# EasyEDA Pro project ProProject_TDeck_18650_Charger_2024-02-11.epro

# Schematic Schematic1
Create Date: 2024-02-10; Page Name: P1; Project Name: TDeck_18650_Charger; Schematic Name: Schematic1; Update Date: 2024-02-10; Company: EasyEDA.com; Drawn: EasyEDA; Page Size: A4; Part Number: JLCPCB-002; Reviewed: EasyEDA; Version: V0.1
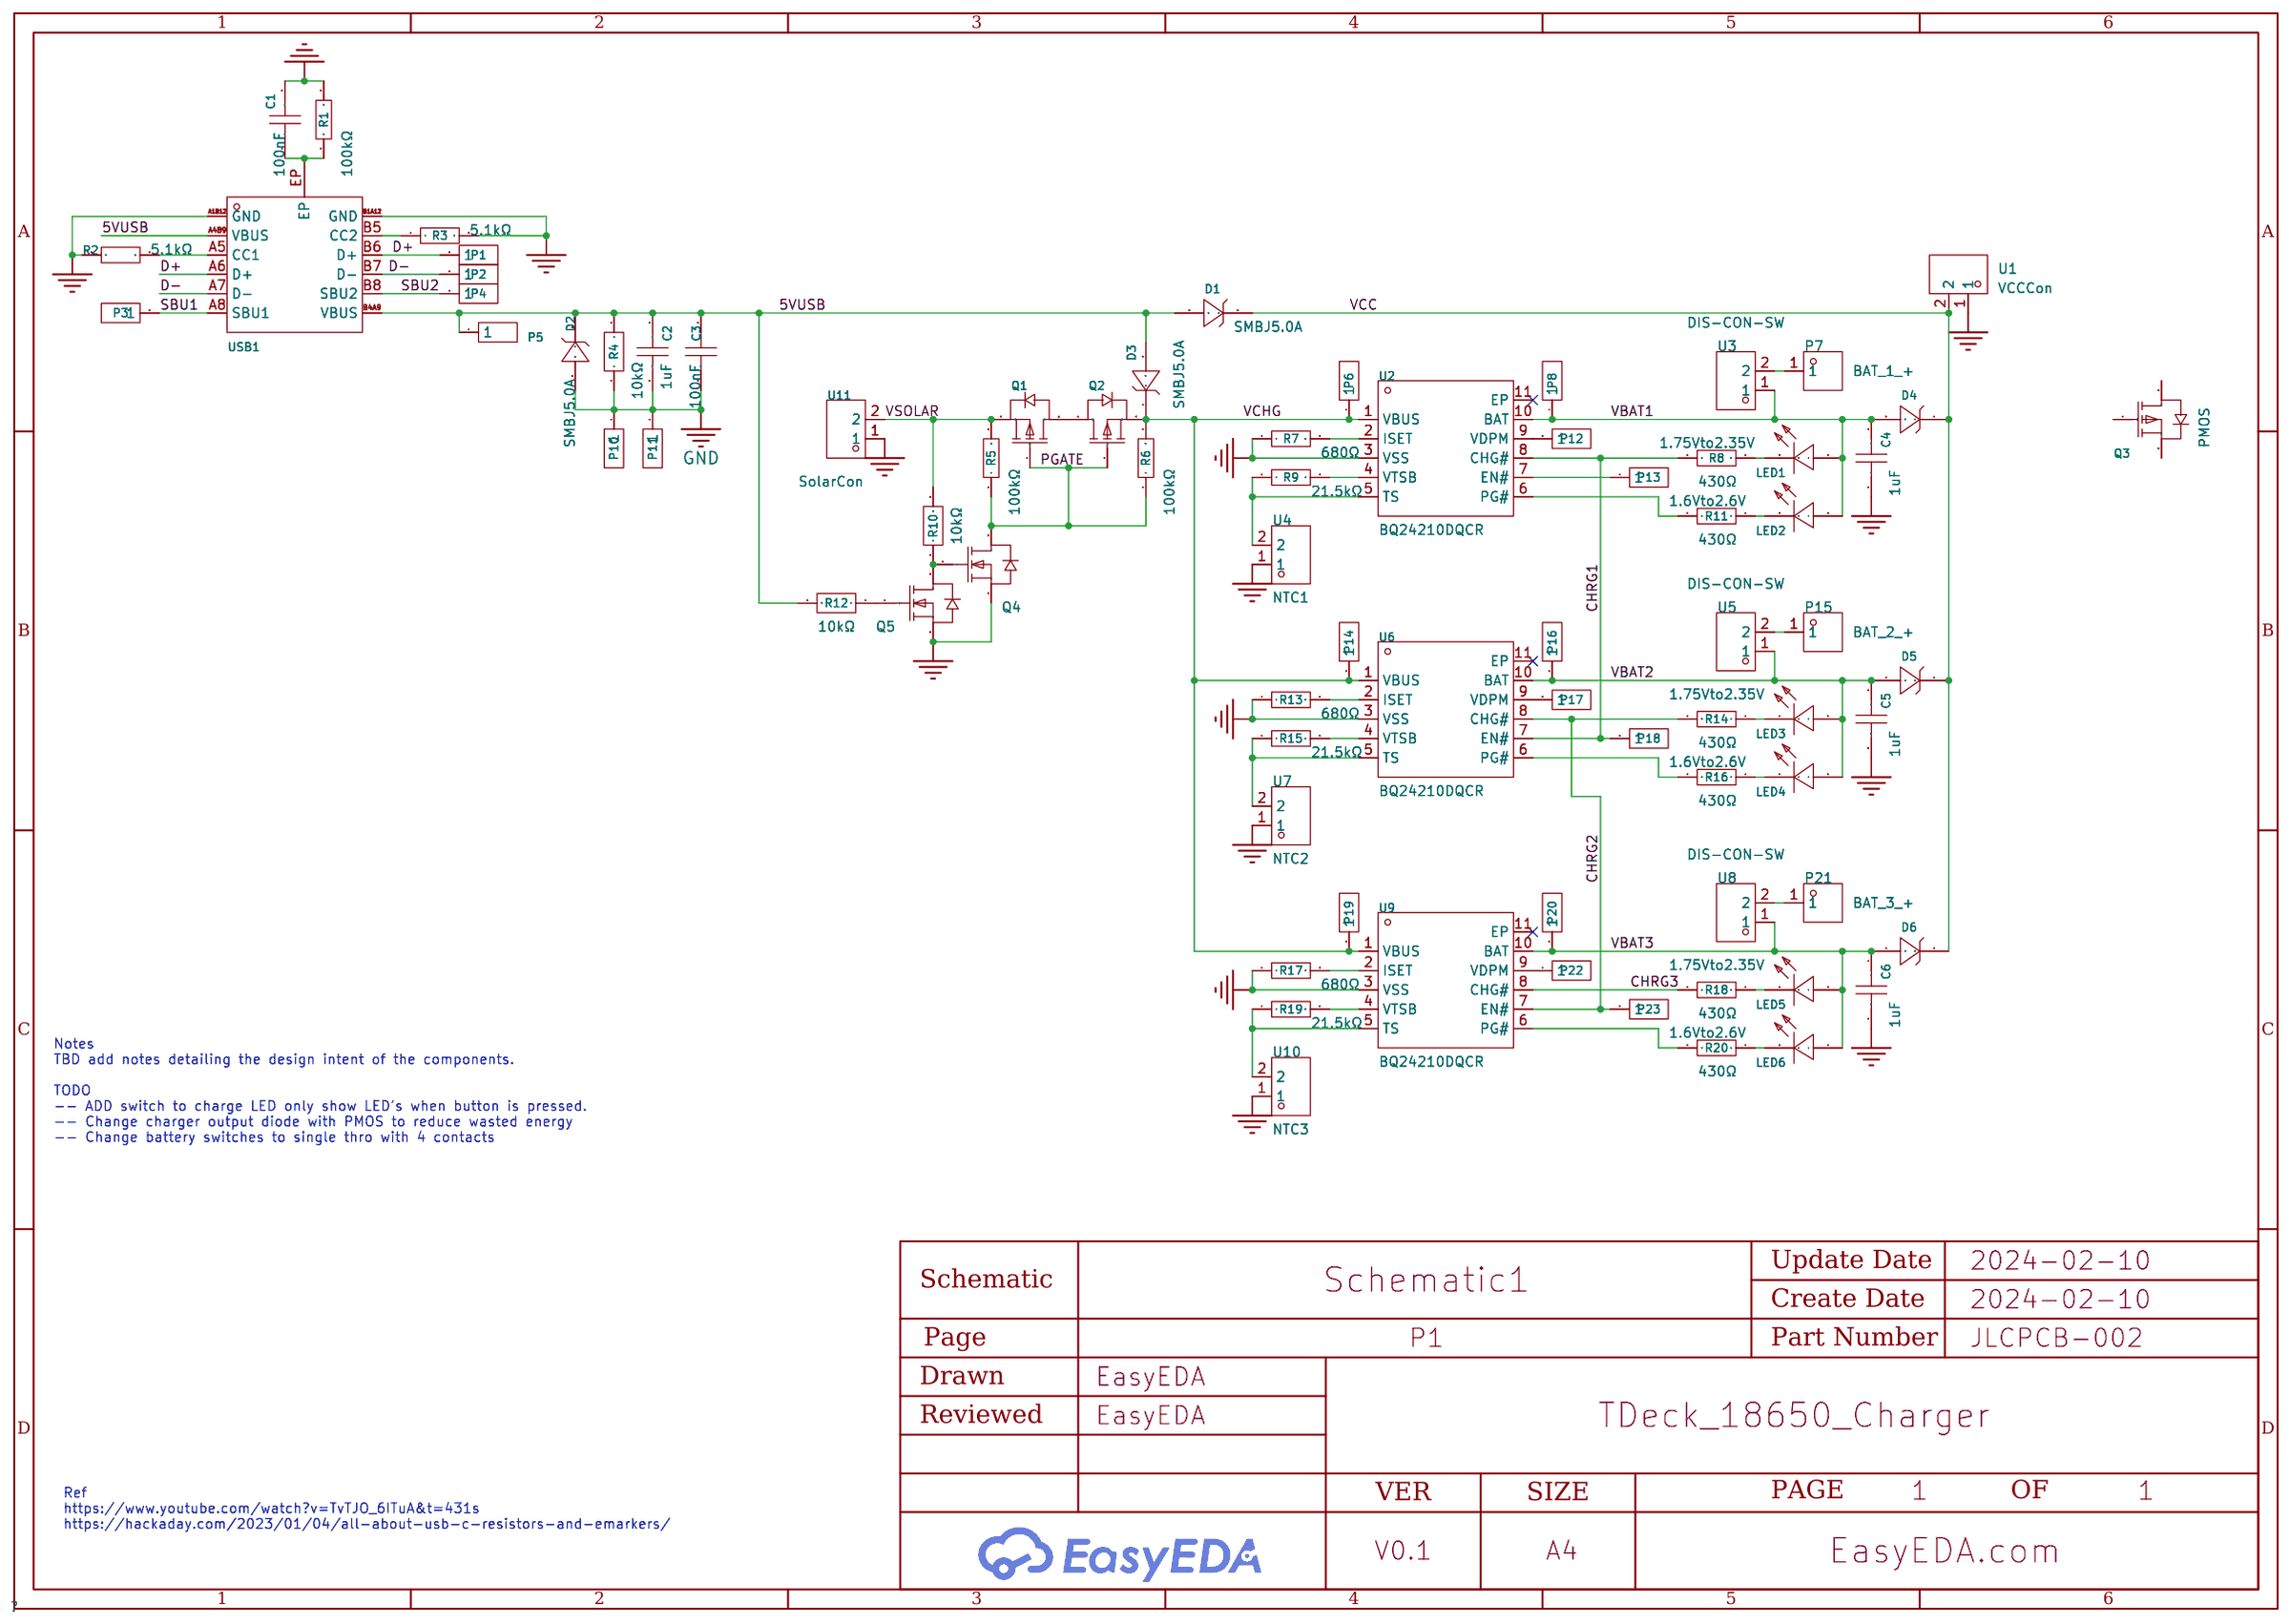
[diagram p0: schematic sheet]

## Parts
C1  100nF  [C0603]
C2  1uF  [C1206]
C3  100nF  [C0603]
C4  1uF  [C1206]
C5  1uF  [C1206]
C6  1uF  [C1206]
D1  SMBJ5.0A  [SMB_L4.4-W3.6-LS5.2-RD]
D2  SMBJ5.0A  [SMB_L4.4-W3.6-LS5.2-RD]
D3  SMBJ5.0A  [SMB_L4.4-W3.6-LS5.2-RD]
D4  SMBJ5.0A  [SMB_L4.4-W3.6-LS5.2-RD]
D5  SMBJ5.0A  [SMB_L4.4-W3.6-LS5.2-RD]
D6  SMBJ5.0A  [SMB_L4.4-W3.6-LS5.2-RD]
LED1  1.75Vto2.35V  [LED0805-RD]
LED2  1.6Vto2.6V  [LED0603-RD]
LED3  1.75Vto2.35V  [LED0805-RD]
LED4  1.6Vto2.6V  [LED0603-RD]
LED5  1.75Vto2.35V  [LED0805-RD]
LED6  1.6Vto2.6V  [LED0603-RD]
P1  2.54-1*1P针  [HDR-TH_1P-P2.54-V-M]  (no BOM)
P2  2.54-1*1P针  [HDR-TH_1P-P2.54-V-M]  (no BOM)
P3  2.54-1*1P针  [HDR-TH_1P-P2.54-V-M]  (no BOM)
P4  2.54-1*1P针  [HDR-TH_1P-P2.54-V-M]  (no BOM)
P5  2.54-1*1P针  [HDR-TH_1P-P2.54-V-M]  (no BOM)
P6  2.54-1*1P针  [HDR-TH_1P-P2.54-V-M]
P7  BAT_1_+  [SMD_BD4.0-L4.0-W4.0-D1.0]
P8  2.54-1*1P针  [HDR-TH_1P-P2.54-V-M]
P10  2.54-1*1P针  [HDR-TH_1P-P2.54-V-M]
P11  2.54-1*1P针  [HDR-TH_1P-P2.54-V-M]
P12  2.54-1*1P针  [HDR-TH_1P-P2.54-V-M]  (no BOM)
P13  2.54-1*1P针  [HDR-TH_1P-P2.54-V-M]  (no BOM)
P14  2.54-1*1P针  [HDR-TH_1P-P2.54-V-M]
P15  BAT_2_+  [SMD_BD4.0-L4.0-W4.0-D1.0]
P16  2.54-1*1P针  [HDR-TH_1P-P2.54-V-M]
P17  2.54-1*1P针  [HDR-TH_1P-P2.54-V-M]  (no BOM)
P18  2.54-1*1P针  [HDR-TH_1P-P2.54-V-M]  (no BOM)
P19  2.54-1*1P针  [HDR-TH_1P-P2.54-V-M]
P20  2.54-1*1P针  [HDR-TH_1P-P2.54-V-M]
P21  BAT_3_+  [SMD_BD4.0-L4.0-W4.0-D1.0]
P22  2.54-1*1P针  [HDR-TH_1P-P2.54-V-M]  (no BOM)
P23  2.54-1*1P针  [HDR-TH_1P-P2.54-V-M]  (no BOM)
Q1  SI2301  [SOT-23-3_L2.9-W1.3-P1.90-LS2.4-BR]
Q2  SI2301  [SOT-23-3_L2.9-W1.3-P1.90-LS2.4-BR]
Q3  PMOS  [SOT-23-3_L2.9-W1.3-P1.90-LS2.4-BR]
Q4  AO3400A  [SOT-23-3_L2.9-W1.6-P1.90-LS2.8-BR]
Q5  AO3400A  [SOT-23-3_L2.9-W1.6-P1.90-LS2.8-BR]
R1  100kΩ  [R0805]
R2  5.1kΩ  [R0805]
R3  5.1kΩ  [R0805]
R4  10kΩ  [R0805]
R5  100kΩ  [R0805]
R6  100kΩ  [R0805]
R7  680Ω  [R0805]
R8  430Ω  [R0603]
R9  21.5kΩ  [R0805]
R10  10kΩ  [R0805]
R11  430Ω  [R0603]
R12  10kΩ  [R0805]
R13  680Ω  [R0805]
R14  430Ω  [R0603]
R15  21.5kΩ  [R0805]
R16  430Ω  [R0603]
R17  680Ω  [R0805]
R18  430Ω  [R0603]
R19  21.5kΩ  [R0805]
R20  430Ω  [R0603]
U1  VCCCon  [HDR-TH_2P-P2.54-V-M-2]
U2  BQ24210DQCR  [WSON-10_L3.0-W2.0-P0.50-BL-EP]
U3  DIS-CON-SW  [HDR-TH_2P-P2.54-V-M-2]
U4  NTC1  [HDR-TH_2P-P2.54-V-M-2]
U5  DIS-CON-SW  [HDR-TH_2P-P2.54-V-M-2]
U6  BQ24210DQCR  [WSON-10_L3.0-W2.0-P0.50-BL-EP]
U7  NTC2  [HDR-TH_2P-P2.54-V-M-2]
U8  DIS-CON-SW  [HDR-TH_2P-P2.54-V-M-2]
U9  BQ24210DQCR  [WSON-10_L3.0-W2.0-P0.50-BL-EP]
U10  NTC3  [HDR-TH_2P-P2.54-V-M-2]
U11  SolarCon  [CONN-TH_XY308-2.54-2P]
USB1  TYPEC-304-ACP16  [USB-C-SMD_TYPE-C-16P-1]

## Library data of the parts
C1 C3 = CC0603KRX7R9BB104: Capacitance: Tolerance:±10% Tolerance:±10% Voltage Rated: Temperature Coefficient:; LCSC Part Name: 100nF ±10% 50V; Supplier Part: C14663; Manufacturer: YAGEO(国巨); Supplier Footprint: 0603; JLCPCB Part Class: Basic Part; Datasheet: https://atta.szlcsc.com/upload/public/pdf/source/20180910/C282072_33301C7F631E79921B82A8DAC6BCC5B3.pdf; Supplier: LCSC; Tolerance: ±10%
C2 C4-C6 = CL31B105KCHNNNE: Capacitance: Tolerance:±10% Tolerance:±10% Voltage Rated: Temperature Coefficient:; LCSC Part Name: 1uF ±10% 100V; Supplier Part: C13832; Manufacturer: SAMSUNG(三星); Supplier Footprint: 1206; JLCPCB Part Class: Extended Part; Datasheet: https://atta.szlcsc.com/upload/public/pdf/source/20160218/1457707763339.pdf; Supplier: LCSC; Tolerance: ±10%
D1-D6 = SMBJ5.0A_C3012487: Reverse Stand-Off Voltage (Vrwm):5V Maximum Clamping Voltage:9.2V Peak Pulse Current (Ipp)@10/1000us:65.3A Peak Pulse Power Dissipation (Ppp)@10/1000us:600W Breakdown Voltage:6.4V Reverse Leakage Current (Ir):500uA Type:TVS; Supplier Part: C3012487; Manufacturer: PAKER(派克微); Supplier Footprint: SMB; JLCPCB Part Class: Extended Part; Datasheet: https://atta.szlcsc.com/upload/public/pdf/source/20220607/3D2A7659A4820C4AE9AE78D6D582D662.pdf; Supplier: LCSC; Reverse Stand-Off Voltage (Vrwm): 5V; Maximum Clamping Voltage: 9.2V; Peak Pulse Current (Ipp)@10/1000us: 65.3A; Peak Pulse Power Dissipation (Ppp)@10/1000us: 600W; Breakdown Voltage: 6.4V; Reverse Leakage Current (Ir): 500uA; Type: TVS
LED1 LED3 LED5 = 17-21/R6C-AQ2R2B/3T: Emitted Color:Red; LCSC Part Name: 停产; Supplier Part: C113551; Manufacturer: EVERLIGHT(亿光); Supplier Footprint: 0805; JLCPCB Part Class: Extended Part; Datasheet: https://atta.szlcsc.com/upload/public/pdf/source/20170914/C113551_1505373979236968871.pdf; Supplier: LCSC; Emitted Color: Red
LED2 LED4 LED6 = NCD0603O2: Emitted Color:Orange Forward Voltage (VF):1.6V~2.6V Forward Voltage (VF):1.6V~2.6V Power Dissipation:65mW Forward Current:20mA Dominant Wavelength:600nm~610nm Dominant Wavelength:600nm~610nm Lens Color:无色透明透镜 Luminous Intensity:100mcd~220mcd Luminous Inte; Supplier Part: C108553; Manufacturer: 国星光电; Supplier Footprint: 0603; JLCPCB Part Class: Extended Part; Datasheet: https://atta.szlcsc.com/upload/public/pdf/source/20200820/C108553_1D8FD80A6A2BFA59936C6C85D97A3AAD.pdf; Supplier: LCSC; Emitted Color: Orange; Forward Voltage (VF): 1.6V~2.6V; Power Dissipation: 65mW; Forward Current: 20mA; Dominant Wavelength: 600nm~610nm; Lens Color: 无色透明透镜; Luminous Intensity: 100mcd~220mcd; Viewing Angle: 130°; Operating Temperature: -30℃~+85℃
P1-P6 P8 P10-P14 P16-P20 P22 P23 = 2.54-1*1P针: Pin Structure:- Pitch:- Row Spacing:- Circluar Pins/Square Pins:- Mounting Type:Straight Number of Rows:Plugin Number of Pins:1P Current Rating (Max):- Voltage Rating (Max):- Length of Mating Pin:- Insulation Height:- Contact Material: Contact Plating:- C; LCSC Part Name: 直插; Supplier Part: C81276; Manufacturer: BOOMELE(博穆精密); Supplier Footprint: 插件,P=2.54mm; JLCPCB Part Class: Extended Part; Datasheet: https://atta.szlcsc.com/upload/public/pdf/source/20221018/3E9408392E35E6F57A28985E5F7BF5C9.pdf; Supplier: LCSC; Mounting Type: Straight; Number of Rows: Plugin; Number of Pins: 1P; Color: Black
P7 P15 P21 = PAD: Supplier Part: C9900017271; JLCPCB Part Class: Extended Part; Supplier: LCSC
Q1 Q2 = SI2301_C2891731: Type: Drain Source Voltage (Vdss): Continuous Drain Current (Id): Power Dissipation (Pd): Drain Source On Resistance (RDS(on)@Vgs,Id):120mΩ@4.5V,1.5A Gate Threshold Voltage (Vgs(th)@Id):1.5V@250uA Total Gate Charge (Qg@Vgs):- Input Capacitance (Ciss@Vds):; LCSC Part Name: P沟道 耐压:20V 电流:2.2A; Supplier Part: C2891731; Manufacturer: YONGYUTAI(永裕泰); Supplier Footprint: SOT-23; JLCPCB Part Class: Extended Part; Datasheet: https://atta.szlcsc.com/upload/public/pdf/source/20210901/BD7F488CADB80954861F21BEE026F08A.pdf; Supplier: LCSC; Drain Source On Resistance (RDS(on)@Vgs,Id): 120mΩ@4.5V,1.5A; Gate Threshold Voltage (Vgs(th)@Id): 1.5V@250uA; Input Capacitance (Ciss@Vds): 200pF@10V
Q3 = SI2301_C2891731: Type: Drain Source Voltage (Vdss): Continuous Drain Current (Id): Power Dissipation (Pd): Drain Source On Resistance (RDS(on)@Vgs,Id):120mΩ@4.5V,1.5A Gate Threshold Voltage (Vgs(th)@Id):1.5V@250uA Total Gate Charge (Qg@Vgs):- Input Capacitance (Ciss@Vds):; LCSC Part Name: P沟道 耐压:20V 电流:2.2A; Supplier Part: C2891731; Manufacturer: YONGYUTAI(永裕泰); Manufacturer Part: SI2301; Supplier Footprint: SOT-23; JLCPCB Part Class: Extended Part; Datasheet: https://atta.szlcsc.com/upload/public/pdf/source/20210901/BD7F488CADB80954861F21BEE026F08A.pdf; Supplier: LCSC; Drain Source On Resistance (RDS(on)@Vgs,Id): 120mΩ@4.5V,1.5A; Gate Threshold Voltage (Vgs(th)@Id): 1.5V@250uA; Input Capacitance (Ciss@Vds): 200pF@10V
Q4 Q5 = AO3400A_C20917: Type: Drain Source Voltage (Vdss): Continuous Drain Current (Id): Power Dissipation (Pd): Drain Source On Resistance (RDS(on)@Vgs,Id):26.5mΩ@10V,5.7A Gate Threshold Voltage (Vgs(th)@Id):1.5V@250uA Total Gate Charge (Qg@Vgs):7nC@4.5V Input Capacitance (Cis; LCSC Part Name: N沟道 耐压:30V 电流:5.7A; Supplier Part: C20917; Manufacturer: AOS; Supplier Footprint: SOT-23-3L; JLCPCB Part Class: Basic Part; Datasheet: https://atta.szlcsc.com/upload/public/pdf/source/20140107/1457706668533.pdf; Supplier: LCSC; Drain Source On Resistance (RDS(on)@Vgs,Id): 26.5mΩ@10V,5.7A; Gate Threshold Voltage (Vgs(th)@Id): 1.5V@250uA; Total Gate Charge (Qg@Vgs): 7nC@4.5V; Input Capacitance (Ciss@Vds): 630pF@15V; Operating Temperature: -55℃~+150℃@(Tj)
R1 R5 R6 = 0805W8F1003T5E: Type:Thick Film Resistors Resistance:100kΩ Tolerance:±1% Tolerance:±1% Power(Watts): Overload Voltage (Max): Temperature Coefficient:±100ppm/℃ Temperature Coefficient:±100ppm/℃ Operating Temperature Range:-55℃~+155℃ Operating Temperature Range:-55℃~+155℃; LCSC Part Name: 100kΩ ±1% 125mW 厚膜电阻; Supplier Part: C149504; Manufacturer: UNI-ROYAL(厚声); Supplier Footprint: 0805; JLCPCB Part Class: Basic Part; Datasheet: https://atta.szlcsc.com/upload/public/pdf/source/20200306/C422600_1E6D84923E4A46A82E41ADD87F860B5C.pdf; Supplier: LCSC; Type: Thick Film Resistors; Tolerance: ±1%; Temperature Coefficient: ±100ppm/℃; Operating Temperature Range: -55℃~+155℃
R2 R3 = 0805W8F5101T5E: Type:Thick Film Resistors Resistance:5.1kΩ Tolerance:±1% Tolerance:±1% Power(Watts): Overload Voltage (Max): Temperature Coefficient:±100ppm/℃ Temperature Coefficient:±100ppm/℃ Operating Temperature Range:-55℃~+155℃ Operating Temperature Range:-55℃~+155℃; LCSC Part Name: 5.1kΩ ±1% 125mW 厚膜电阻; Supplier Part: C27834; Manufacturer: UNI-ROYAL(厚声); Supplier Footprint: 0805; JLCPCB Part Class: Basic Part; Datasheet: https://atta.szlcsc.com/upload/public/pdf/source/20200306/C422600_1E6D84923E4A46A82E41ADD87F860B5C.pdf; Supplier: LCSC; Type: Thick Film Resistors; Tolerance: ±1%; Temperature Coefficient: ±100ppm/℃; Operating Temperature Range: -55℃~+155℃
R4 R10 R12 = AR05DTD1002: Resistance: Tolerance:±0.5% Tolerance:±0.5% Temperature Coefficient:±50ppm/℃ Temperature Coefficient:±50ppm/℃; LCSC Part Name: 10kΩ ±0.5%; Supplier Part: C5120082; Manufacturer: Viking(光颉); Supplier Footprint: 0805; JLCPCB Part Class: Extended Part; Datasheet: https://atta.szlcsc.com/upload/public/pdf/source/20220808/FEB8974641219B05EC1DF578AF1AC27C.pdf; Supplier: LCSC; Tolerance: ±0.5%; Temperature Coefficient: ±50ppm/℃
R7 R13 R17 = 0805W8F6800T5E: Type:Thick Film Resistors Resistance: Tolerance:±1% Tolerance:±1% Power(Watts): Overload Voltage (Max): Temperature Coefficient:±100ppm/℃ Temperature Coefficient:±100ppm/℃ Operating Temperature Range:-55℃~+155℃ Operating Temperature Range:-55℃~+155℃; LCSC Part Name: 680Ω ±1% 125mW 厚膜电阻; Supplier Part: C17798; Manufacturer: UNI-ROYAL(厚声); Supplier Footprint: 0805; JLCPCB Part Class: Basic Part; Datasheet: https://atta.szlcsc.com/upload/public/pdf/source/20200306/C422600_1E6D84923E4A46A82E41ADD87F860B5C.pdf; Supplier: LCSC; Type: Thick Film Resistors; Tolerance: ±1%; Temperature Coefficient: ±100ppm/℃; Operating Temperature Range: -55℃~+155℃
R8 R11 R14 R16 R18 R20 = 0603WAF4300T5E: Type:Thick Film Resistors Resistance: Tolerance:±1% Tolerance:±1% Power(Watts): Overload Voltage (Max): Temperature Coefficient:±100ppm/℃ Temperature Coefficient:±100ppm/℃ Operating Temperature Range:-55℃~+155℃ Operating Temperature Range:-55℃~+155℃; LCSC Part Name: 430Ω ±1% 100mW 厚膜电阻; Supplier Part: C23170; Manufacturer: UNI-ROYAL(厚声); Supplier Footprint: 0603; JLCPCB Part Class: Extended Part; Datasheet: https://atta.szlcsc.com/upload/public/pdf/source/20200306/C422600_1E6D84923E4A46A82E41ADD87F860B5C.pdf; Supplier: LCSC; Type: Thick Film Resistors; Tolerance: ±1%; Temperature Coefficient: ±100ppm/℃; Operating Temperature Range: -55℃~+155℃
R9 R15 R19 = CR0805-FX-2152ELF: Type:Thick Film Resistors Resistance: Tolerance:±1% Tolerance:±1% Power(Watts): Temperature Coefficient:±100ppm/℃ Temperature Coefficient:±100ppm/℃ Operating Temperature Range:-55℃~+155℃ Operating Temperature Range:-55℃~+155℃; LCSC Part Name: 厚膜电阻 21.5kΩ ±1% 125mW; Supplier Part: C203849; Manufacturer: BOURNS; Supplier Footprint: 0805; JLCPCB Part Class: Extended Part; Datasheet: https://atta.szlcsc.com/upload/public/pdf/source/20181212/C205087_1ACD03E1A16EE5293BD8A283223FEE72.pdf; Supplier: LCSC; Type: Thick Film Resistors; Tolerance: ±1%; Temperature Coefficient: ±100ppm/℃; Operating Temperature Range: -55℃~+155℃
U1 U3-U5 U7 U8 U10 = 5-146472-2: Pitch:2.54mm Mounting Type:Straight Number of Rows:Plugin Number of Pins:2P Contact Plating:Gold Color:Black; LCSC Part Name: 间距:2.54mm 直插; Supplier Part: C6818945; Manufacturer: TE Connectivity(泰科电子); Supplier Footprint: 插件,P=2.54mm; Datasheet: https://atta.szlcsc.com/upload/public/pdf/source/231023/ENG_CD_146472_A1-a2ecdd3f4f0c38dab3630f573445b12b.pdf; Supplier: LCSC; Pitch: 2.54mm; Mounting Type: Straight; Number of Rows: Plugin; Number of Pins: 2P; Contact Plating: Gold; Color: Black
U2 U6 U9 = BQ24210DQCR: Supplier Part: C524795; Manufacturer: TI(德州仪器); Supplier Footprint: WSON-10-EP(2x3); JLCPCB Part Class: Extended Part; Datasheet: https://www.ti.com/cn/lit/gpn/bq24210; Supplier: LCSC
U11 = XY308-2.54-2P: Structure:1x2P Pitch:2.54mm Color:Green Mounting Style:Straight Current Rating (Max):6A Voltage Rating (Max):150V Number of Pins:2P Number of Rows:1 Wire Gauge - AWG:18~26 Wire Gauge - AWG:18~26 Wire Gauge - mm2:1 Wire Gauge - mm2:1 Number of PINs Per Row; LCSC Part Name: 2.54mm 1x2P 排数:1 每排P数:2 直插; Supplier Part: C557685; Manufacturer: XINLAIYA(新莱亚); Supplier Footprint: 插件,P=2.54mm; JLCPCB Part Class: Extended Part; Datasheet: https://atta.szlcsc.com/upload/public/pdf/source/20200527/C557686_13715264167F455C722D771DE12648FD.pdf; Supplier: LCSC; Structure: 1x2P; Pitch: 2.54mm; Color: Green; Mounting Style: Straight; Current Rating (Max): 6A; Voltage Rating (Max): 150V; Number of Pins: 2P; Number of Rows: 1; Wire Gauge - AWG: 18~26; Wire Gauge - mm2: 1; Number of PINs Per Row: 2
USB1 = TYPEC-304-ACP16: Connector Type:Type-C Standard:- Gender:Female Number of Ports:1 Number of Contacts:16P Mounting Style:卧贴 Current Rating - Power (Max):3A Contact Material:Copper Contact Plating:Gold Operating Temperature Range:-40℃~+85℃ Operating Temperature Range:-40℃~+; LCSC Part Name: Type-C 母 卧贴; Supplier Part: C2982555; Manufacturer: XUNPU(讯普); Supplier Footprint: SMD; JLCPCB Part Class: Extended Part; Datasheet: https://atta.szlcsc.com/upload/public/pdf/source/20220311/3C907F75E12F45E4EE7F73565AB9C294.pdf; Supplier: LCSC; Connector Type: Type-C; Gender: Female; Number of Ports: 1; Number of Contacts: 16P; Mounting Style: 卧贴; Current Rating - Power (Max): 3A; Contact Material: Copper; Contact Plating: Gold; Operating Temperature Range: -40℃~+85℃

## Nets
5VUSB: C2.1 C3.2 D1.2 D2.1 D3.2 P5.1 R4.2 R12.2 USB1.A4B9(VBUS) USB1.B4A9(VBUS)
GND: C1.2 C2.2 C3.1 C4.2 C5.2 C6.2 D2.2 P10.1 P11.1 Q4.2(S) Q5.2(S) R1.2 R2.1 R3.2 R4.1 R7.1 R13.1 R17.1 U1.1 U2.3(VSS) U4.1 U6.3(VSS) U7.1 U9.3(VSS) U10.1 U11.1 USB1.A1B12(GND) USB1.B1A12(GND)
VBAT1: C4.1 D4.2 LED1.2(A) LED2.2(A) P8.1 U2.10(BAT) U3.1
VBAT2: C5.1 D5.2 LED3.2(A) LED4.2(A) P16.1 U5.1 U6.10(BAT)
VBAT3: C6.1 D6.2 LED5.2(A) LED6.2(A) P20.1 U8.1 U9.10(BAT)
VCC: D1.1 D4.1 D5.1 D6.1 U1.2
CHRG1: P18.1 R8.2 U2.8(CHG#) U6.7(EN#)
CHRG2: P23.1 R14.2 U6.8(CHG#) U9.7(EN#)
CHRG3: R18.2 U9.8(CHG#)
D+: P1.1 USB1.A6(D+) USB1.B6(D+)
D-: P2.1 USB1.A7(D-) USB1.B7(D-)
PGATE: Q1.1(G) Q2.1(G) Q4.3(D) R5.1 R6.1
SBU1: P3.1 USB1.A8(SBU1)
SBU2: P4.1 USB1.B8(SBU2)
VCHG: D3.1 P6.1 P14.1 P19.1 Q2.2(S) R6.2 U2.1(VBUS) U6.1(VBUS) U9.1(VBUS)
VSOLAR: Q1.2(S) R5.2 R10.2 U11.2
$1N867: LED2.1(K) R11.1
$1N906: LED1.1(K) R8.1
$1N1095: R11.2 U2.6(PG#)
$1N1336: R7.2 U2.2(ISET)
$1N1382: R9.2 U2.4(VTSB)
$1N1737: P13.1 U2.7(EN#)
$1N1739: P12.1 U2.9(VDPM)
$1N1977: R3.1 USB1.B5(CC2)
$1N1993: R2.2 USB1.A5(CC1)
$1N2563: C1.1 R1.1 USB1.EP
$1N3638: R9.1 U2.5(TS) U4.2
$1N3770: Q1.3(D) Q2.3(D)
$1N4133: Q4.1(G) Q5.3(D) R10.1
$1N4200: Q5.1(G) R12.1
$1N4528: P7.1 U3.2
$1N5234: LED4.1(K) R16.1
$1N5236: LED3.1(K) R14.1
$1N5240: R16.2 U6.6(PG#)
$1N5246: R13.2 U6.2(ISET)
$1N5248: R15.2 U6.4(VTSB)
$1N5252: P17.1 U6.9(VDPM)
$1N5260: R15.1 U6.5(TS) U7.2
$1N5275: P15.1 U5.2
$1N5913: LED6.1(K) R20.1
$1N5915: LED5.1(K) R18.1
$1N5919: R20.2 U9.6(PG#)
$1N5925: R17.2 U9.2(ISET)
$1N5927: R19.2 U9.4(VTSB)
$1N5931: P22.1 U9.9(VDPM)
$1N5939: R19.1 U9.5(TS) U10.2
$1N5954: P21.1 U8.2

Not connected (* = marked no-connect by the designer): Q3 1(G) 2(S) 3(D); U2 11(EP)*; U6 11(EP)*; U9 11(EP)*

## Notes on the sheet
- Notes
  TBD add notes detailing the design intent of the components.
  TODO
  -- ADD switch to charge LED only show LED's when button is pressed.
  -- Change charger output diode with PMOS to reduce wasted energy
  -- Change battery switches to single thro with 4 contacts
- Ref
  https://www.youtube.com/watch?v=TvTJO_6ITuA&t=431s
  https://hackaday.com/2023/01/04/all-about-usb-c-resistors-and-emarkers/

# Board PCB1
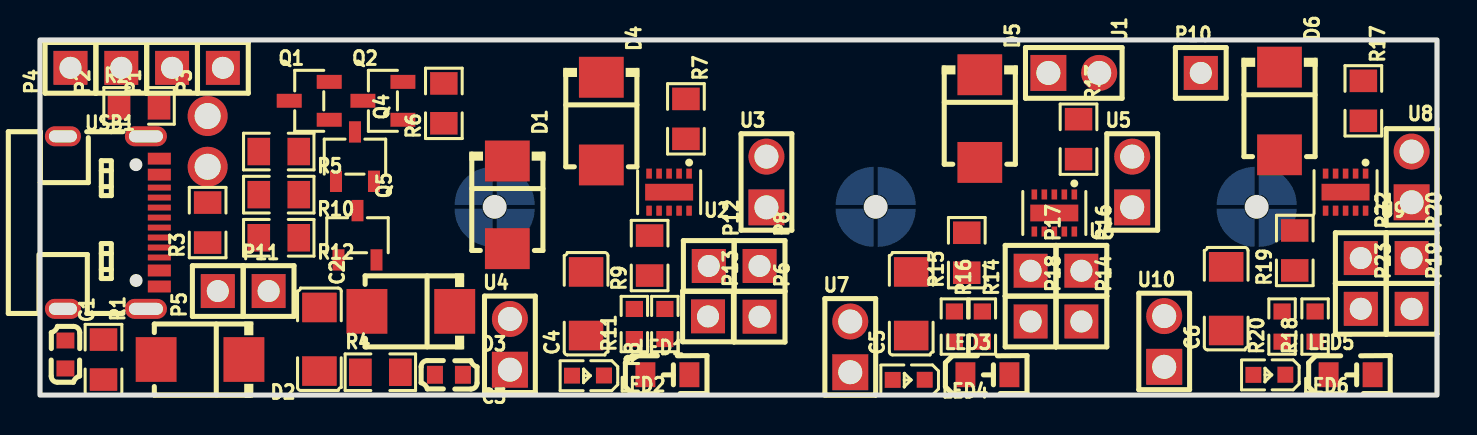
[diagram p1: board, top side]
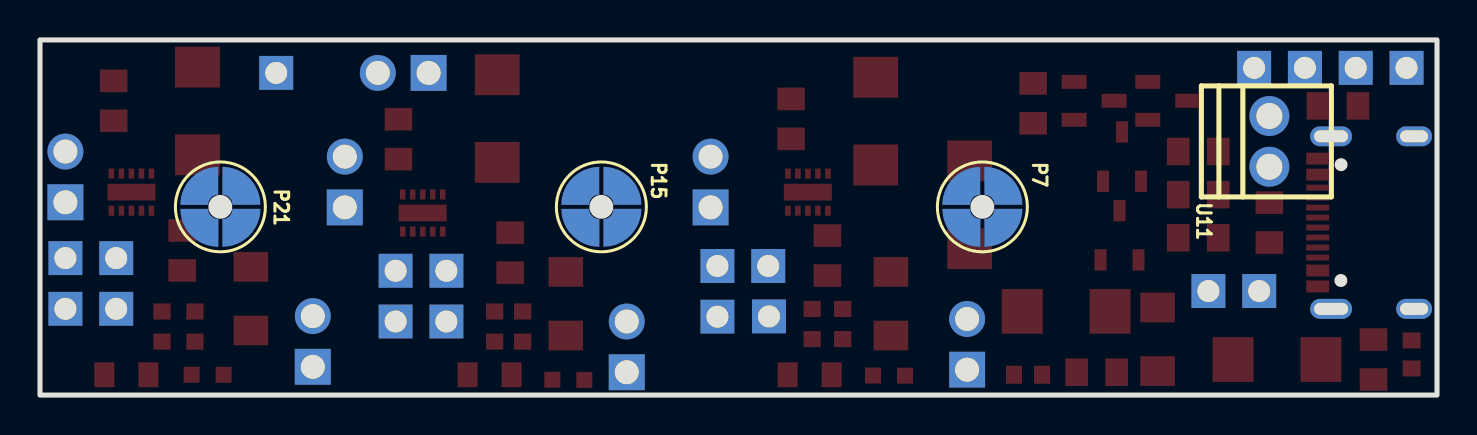
[diagram p2: board, bottom side, seen from below]

Outline 69.85 x 17.78 mm; copper layers: Top Layer, Bottom Layer. Coordinates in mm from the lower left corner of the outline.
Outline path: rectangle 0,17.78 69.85,0
Stack: Top Layer 0.035mm / Dielectric1 1.51mm FR4 er 4.5 / Bottom Layer 0.035mm

## Design rules (mm)
template: JLCPCB Capability(Two Layers Board)
spacing copperThickness1oz (default): track to track 0.102, other pairs 0.152 to 0.3
spacing copperThickness2oz: track to track 0.203, other pairs 0.152 to 0.3
track width copperThickness1oz (default): min 0.127, default 0.254, max 2.54
track width copperThickness2oz: min 0.203, default 0.254, max 2.54
differential pair differentialPair (default): width min 0.127, default 0.254, max 2.54; gap min 0.152, default 0.152
via viaSize (default): diameter min 0.5, default 0.61, max 10; hole min 0.3, default 0.305, max 6.3

## Placement (name value [footprint] x y rotation side)
C1  100nF  [C0603]  1.27 2.03 270 top
C2  1uF  [C1206]  13.97 2.79 270 top
C3  100nF  [C0603]  20.45 1.02 180 top
C4  1uF  [C1206]  27.31 4.57 90 top
C5  1uF  [C1206]  43.56 4.57 90 top
C6  1uF  [C1206]  59.31 4.83 90 top
D1  SMBJ5.0A  [SMB_L4.4-W3.6-LS5.2-RD]  23.37 9.53 270 top
D2  SMBJ5.0A  [SMB_L4.4-W3.6-LS5.2-RD]  8 1.78 180 top
D3  SMBJ5.0A  [SMB_L4.4-W3.6-LS5.2-RD]  18.54 4.19 180 top
D4  SMBJ5.0A  [SMB_L4.4-W3.6-LS5.2-RD]  28.07 13.72 270 top
D5  SMBJ5.0A  [SMB_L4.4-W3.6-LS5.2-RD]  46.99 13.84 270 top
D6  SMBJ5.0A  [SMB_L4.4-W3.6-LS5.2-RD]  61.98 14.22 270 top
LED1  1.75Vto2.35V  [LED0805-RD]  31.37 1.02 0 top
LED2  1.6Vto2.6V  [LED0603-RD]  27.4 0.97 180 top
LED3  1.75Vto2.35V  [LED0805-RD]  47.37 1.02 0 top
LED4  1.6Vto2.6V  [LED0603-RD]  43.43 0.76 180 top
LED5  1.75Vto2.35V  [LED0805-RD]  65.53 1.02 0 top
LED6  1.6Vto2.6V  [LED0603-RD]  61.47 1.02 180 top
P1  2.54-1*1P针  [HDR-TH_1P-P2.54-V-M]  6.6 16.38 90 top
P2  2.54-1*1P针  [HDR-TH_1P-P2.54-V-M]  4.06 16.38 90 top
P3  2.54-1*1P针  [HDR-TH_1P-P2.54-V-M]  9.14 16.38 90 top
P4  2.54-1*1P针  [HDR-TH_1P-P2.54-V-M]  1.52 16.38 90 top
P5  2.54-1*1P针  [HDR-TH_1P-P2.54-V-M]  8.89 5.21 90 top
P6  2.54-1*1P针  [HDR-TH_1P-P2.54-V-M]  35.98 3.92 270 top
P7  BAT_1_+  [SMD_BD4.0-L4.0-W4.0-D1.0]  22.73 9.42 270 bottom
P8  2.54-1*1P针  [HDR-TH_1P-P2.54-V-M]  35.98 6.46 270 top
P10  2.54-1*1P针  [HDR-TH_1P-P2.54-V-M]  58.04 16.13 0 top
P11  2.54-1*1P针  [HDR-TH_1P-P2.54-V-M]  11.43 5.21 0 top
P12  2.54-1*1P针  [HDR-TH_1P-P2.54-V-M]  33.44 6.46 270 top
P13  2.54-1*1P针  [HDR-TH_1P-P2.54-V-M]  33.4 3.94 270 top
P14  2.54-1*1P针  [HDR-TH_1P-P2.54-V-M]  52.07 3.68 270 top
P15  BAT_2_+  [SMD_BD4.0-L4.0-W4.0-D1.0]  41.78 9.42 270 bottom
P16  2.54-1*1P针  [HDR-TH_1P-P2.54-V-M]  52.07 6.22 270 top
P17  2.54-1*1P针  [HDR-TH_1P-P2.54-V-M]  49.53 6.22 270 top
P18  2.54-1*1P针  [HDR-TH_1P-P2.54-V-M]  49.53 3.68 270 top
P19  2.54-1*1P针  [HDR-TH_1P-P2.54-V-M]  68.58 4.32 270 top
P20  2.54-1*1P针  [HDR-TH_1P-P2.54-V-M]  68.58 6.86 270 top
P21  BAT_3_+  [SMD_BD4.0-L4.0-W4.0-D1.0]  60.83 9.42 270 bottom
P22  2.54-1*1P针  [HDR-TH_1P-P2.54-V-M]  66.04 6.86 270 top
P23  2.54-1*1P针  [HDR-TH_1P-P2.54-V-M]  66.04 4.32 270 top
Q1  SI2301  [SOT-23-3_L2.9-W1.3-P1.90-LS2.4-BR]  13.46 14.73 0 top
Q2  SI2301  [SOT-23-3_L2.9-W1.3-P1.90-LS2.4-BR]  17.14 14.73 0 top
Q4  AO3400A  [SOT-23-3_L2.9-W1.6-P1.90-LS2.8-BR]  15.75 11.94 270 top
Q5  AO3400A  [SOT-23-3_L2.9-W1.6-P1.90-LS2.8-BR]  15.88 8 270 top
R1  100kΩ  [R0805]  3.17 1.78 270 top
R2  5.1kΩ  [R0805]  4.95 14.48 0 top
R3  5.1kΩ  [R0805]  8.38 8.64 90 top
R4  10kΩ  [R0805]  17.02 1.14 0 top
R5  100kΩ  [R0805]  11.94 12.19 180 top
R6  100kΩ  [R0805]  20.19 14.61 90 top
R7  680Ω  [R0805]  32.3 13.83 270 top
R8  430Ω  [R0603]  31.24 3.56 90 top
R9  21.5kΩ  [R0805]  30.48 6.98 90 top
R10  10kΩ  [R0805]  11.94 10.03 180 top
R11  430Ω  [R0603]  29.72 3.56 90 top
R12  10kΩ  [R0805]  11.94 7.87 180 top
R13  680Ω  [R0805]  51.93 12.81 270 top
R14  430Ω  [R0603]  47.12 3.43 270 top
R15  21.5kΩ  [R0805]  46.34 7.13 90 top
R16  430Ω  [R0603]  45.72 3.43 270 top
R17  680Ω  [R0805]  66.17 14.73 270 top
R18  430Ω  [R0603]  63.75 3.43 90 top
R19  21.5kΩ  [R0805]  62.74 7.24 90 top
R20  430Ω  [R0603]  62.1 3.43 90 top
U1  VCCCon  [HDR-TH_2P-P2.54-V-M-2]  51.69 16.13 270 top
U2  BQ24210DQCR  [WSON-10_L3.0-W2.0-P0.50-BL-EP]  31.46 10.16 180 top
U3  DIS-CON-SW  [HDR-TH_2P-P2.54-V-M-2]  36.32 10.67 0 top
U4  NTC1  [HDR-TH_2P-P2.54-V-M-2]  23.5 2.54 0 top
U5  DIS-CON-SW  [HDR-TH_2P-P2.54-V-M-2]  54.61 10.67 0 top
U6  BQ24210DQCR  [WSON-10_L3.0-W2.0-P0.50-BL-EP]  50.72 9.12 180 top
U7  NTC2  [HDR-TH_2P-P2.54-V-M-2]  40.51 2.41 0 top
U8  DIS-CON-SW  [HDR-TH_2P-P2.54-V-M-2]  68.58 10.92 0 top
U9  BQ24210DQCR  [WSON-10_L3.0-W2.0-P0.50-BL-EP]  65.28 10.16 180 top
U10  NTC3  [HDR-TH_2P-P2.54-V-M-2]  56.21 2.68 0 top
U11  SolarCon  [CONN-TH_XY308-2.54-2P]  8.38 12.7 90 bottom
USB1  TYPEC-304-ACP16  [USB-C-SMD_TYPE-C-16P-1]  3.56 8.64 270 top

## Footprints (pads in the part's own frame, mm; a bottom-side part is the same pattern mirrored in y, then rotated)
C0603
  rect 0.8x0.9 smd: 1(-0.7,0) 2(0.7,0)
C1206
  rect 1.485x1.728 smd: 1(-1.593,0) 2(1.593,0)
CONN-TH_XY308-2.54-2P
  round 2 hole 1.3: 1(-1.27,0) 2(1.27,0)
HDR-TH_1P-P2.54-V-M
  rect 1.7x1.7 hole 1.1: 1(0,0)
HDR-TH_2P-P2.54-V-M-2
  rect 1.8x1.8 hole 1.2: 1(0,-1.27)
  round 1.8 hole 1.2: 2(0,1.27)
LED0603-RD
  rect 0.8x0.8 smd: 1(-0.799,-0.004) 2(0.799,0.004)
LED0805-RD
  rect 1x1.25 smd: 1(-1.1,0) 2(1.1,0)
R0603
  rect 0.806x0.864 smd: 1(-0.753,0) 2(0.753,0)
R0805
  rect 1.133x1.377 smd: 1(-1,0) 2(1,0)
SMB_L4.4-W3.6-LS5.2-RD
  rect 2.047x2.241 smd: 1(-2.195,0) 2(2.195,0)
SMD_BD4.0-L4.0-W4.0-D1.0
  custom 1.9x1.9 smd: 1(-1.052,0.921) 1(-0.921,-1.052) 1(0.921,1.052) 1(1.052,-0.921)
SOT-23-3_L2.9-W1.3-P1.90-LS2.4-BR
  rect 1.25x0.7 smd: 1(1,-0.95) 2(1,0.95) 3(-1,0)
SOT-23-3_L2.9-W1.6-P1.90-LS2.8-BR
  rect 1.07x0.6 smd: 1(1.235,-0.95) 2(1.235,0.95) 3(-1.235,0)
USB-C-SMD_TYPE-C-16P-1
  rect 0.6x1.15 smd: A1B12(-3.2,2.41) A4B9(-2.4,2.41) B1A12(3.2,2.41) B4A9(2.4,2.41)
  rect 0.3x1.15 smd: A5(-1.25,2.41) A6(-0.25,2.41) A7(0.25,2.41) A8(1.25,2.41) B5(1.75,2.41) B6(0.75,2.41) B7(-0.75,2.41) B8(-1.75,2.41)
  oval 1x2.1 hole 0.6x1.7: EP(-4.32,1.74) EP(4.32,1.74)
  oval 1x1.8 hole 0.6x1.4: EP(-4.32,-2.41) EP(4.32,-2.41)
WSON-10_L3.0-W2.0-P0.50-BL-EP
  rect 0.28x0.505 smd: 1(-1,-0.927) 2(-0.5,-0.927) 3(0,-0.927) 4(0.5,-0.927) 5(1,-0.927) 6(1,0.927) 7(0.5,0.927) 8(0,0.927) 9(-0.5,0.927) 10(-1,0.927)
  rect 2.4x0.84 smd: 11(0,0)

## Nets
As in the schematic.

Pads without a net: U2 11; U6 11; U9 11
